# EAGLE design MintyStick-v3.0 (EAGLE 5.11)
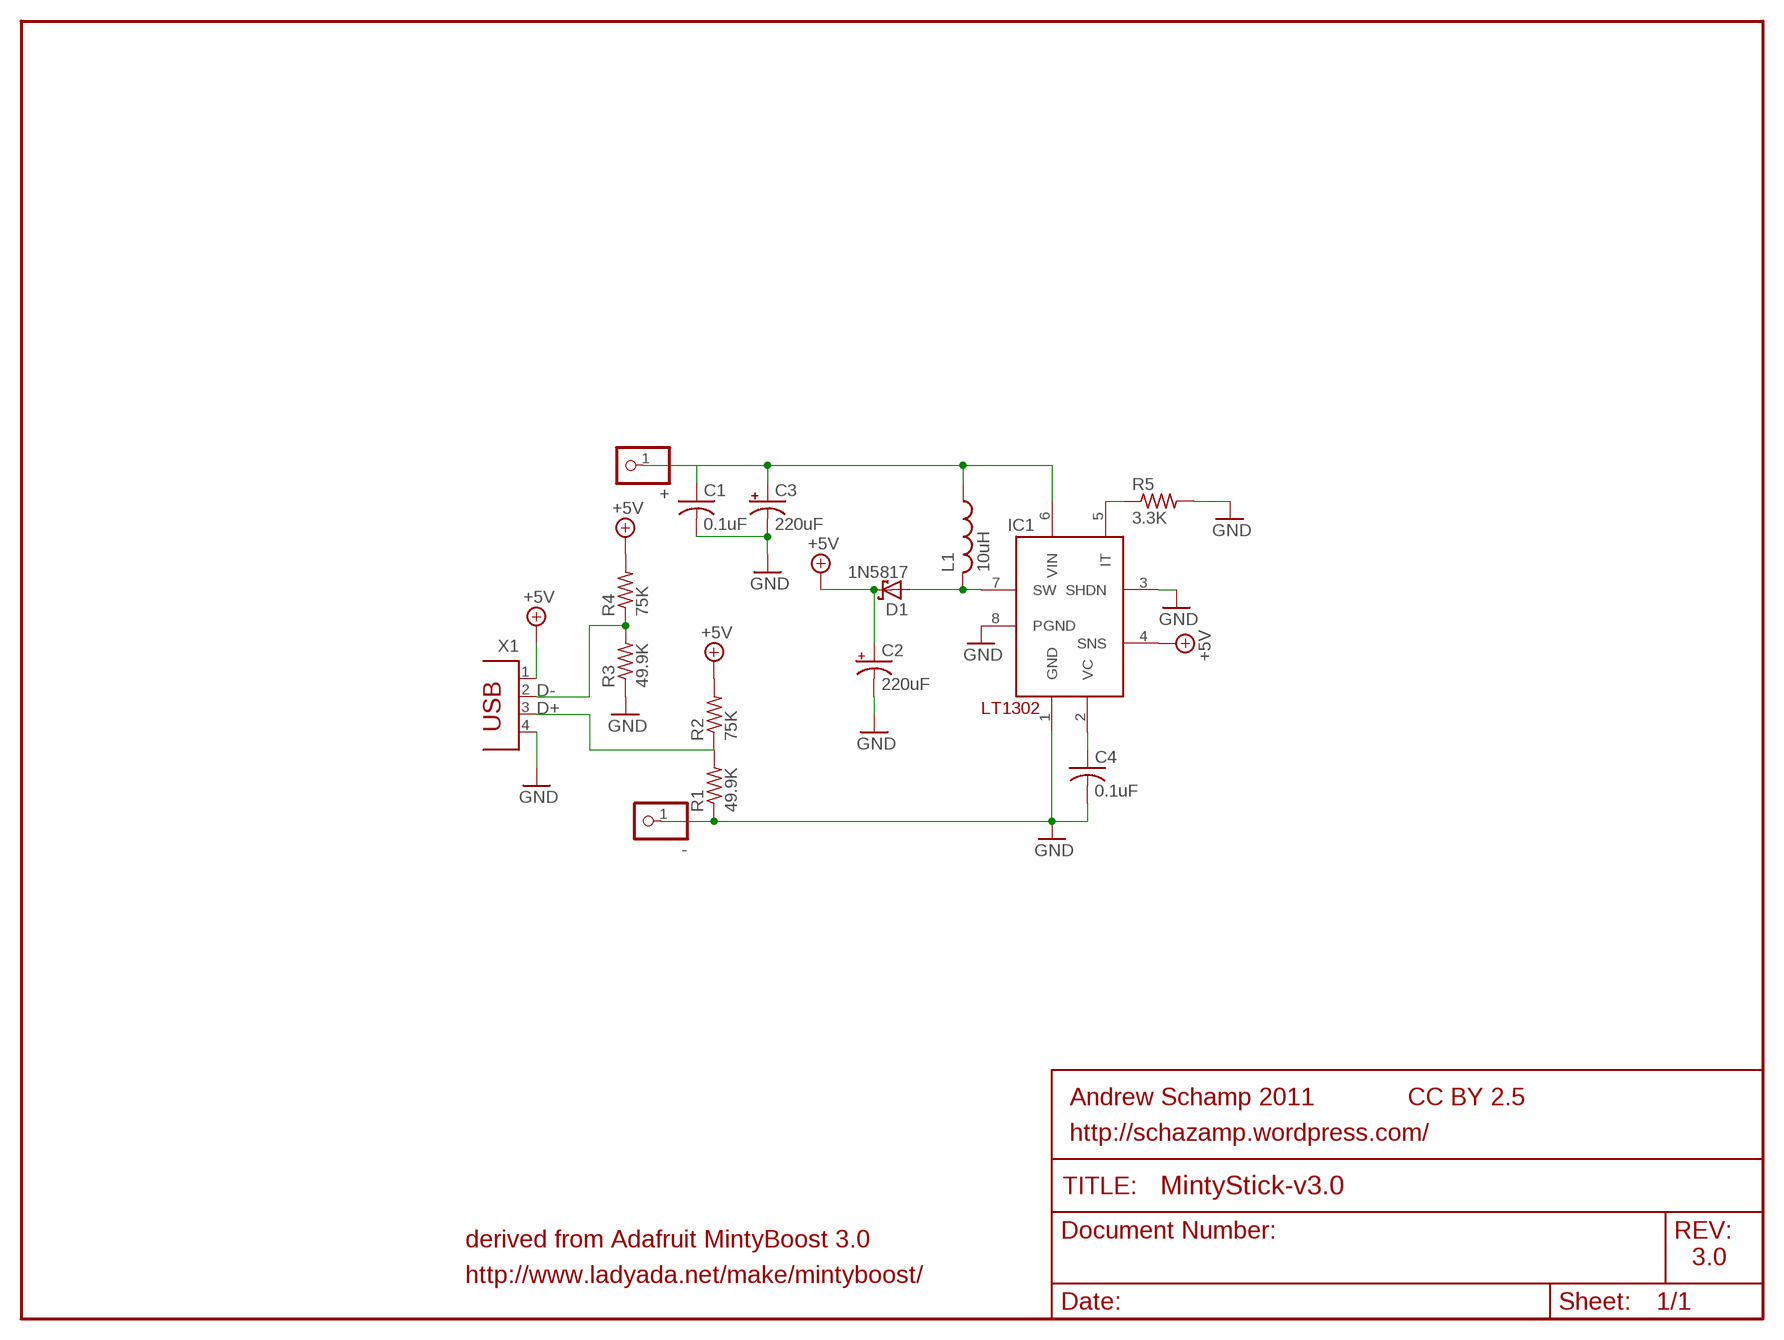
[diagram p0: schematic, sheet 1]

## Parts
+  PINHD-1X1  [1X01]
-  PINHD-1X1  [1X01]
C1  0.1uF  C-US025-024X044  [C025-024X044]
C2  220uF  CPOL-USE2.5-6  [E2,5-6]
C3  220uF  CPOL-USE2.5-6  [E2,5-6]
C4  0.1uF  C-US025-024X044  [C025-024X044]
D1  1N5817  SCHOTTKY-DIODEDO41  [DO41-10]
IC1  LT1302  [DIL08]
L1  10uH  L  [6000]
R1  49.9K  R-US_0207/7  [0207/7]
R2  75K  R-US_0207/7  [0207/7]
R3  49.9K  R-US_0207/7  [0207/7]
R4  75K  R-US_0207/7  [0207/7]
R5  3.3K  R-US_0207/5V  [0207/5V]
X1  PN87520  [PN87520]

## Nets
+5V: C2.+ D1.C IC1.4(SNS) R2.2 R4.2 X1.1
D+: R1.2 R2.1 X1.3
D-: R3.2 R4.1 X1.2
GND: -.1 C1.2 C2.- C3.- C4.2 IC1.1(GND) IC1.3(SHDN) IC1.8(PGND) R1.1 R3.1 R5.2 X1.4
N$1: C4.1 IC1.2(VC)
N$2: +.1 C1.1 C3.+ IC1.6(VIN) L1.1
N$3: IC1.5(IT) R5.1
N$5: D1.A IC1.7(SW) L1.2

## Notes on the sheet
- Andrew Schamp 2011 | CC BY 2.5
- http://schazamp.wordpress.com/
- derived from Adafruit MintyBoost 3.0
- 3.0
- http://www.ladyada.net/make/mintyboost/

## Library data of the parts
+ - = pinhead-ez:PINHD-1X1: PIN HEADER
C1 C4 = rcl-ez:C-US: CAPACITOR, American symbol
C2 C3 = rcl-ez:CPOL-US: POLARIZED CAPACITOR, American symbol
D1 = usbbuck:SCHOTTKY-DIODE: Schottky Diode
IC1 = usbbuck:LT1302
L1 = usbbuck:L
R1-R5 = rcl-ez:R-US_: RESISTOR, American symbol
X1 = con-berg:PN87520: BERG USB connector

## Board
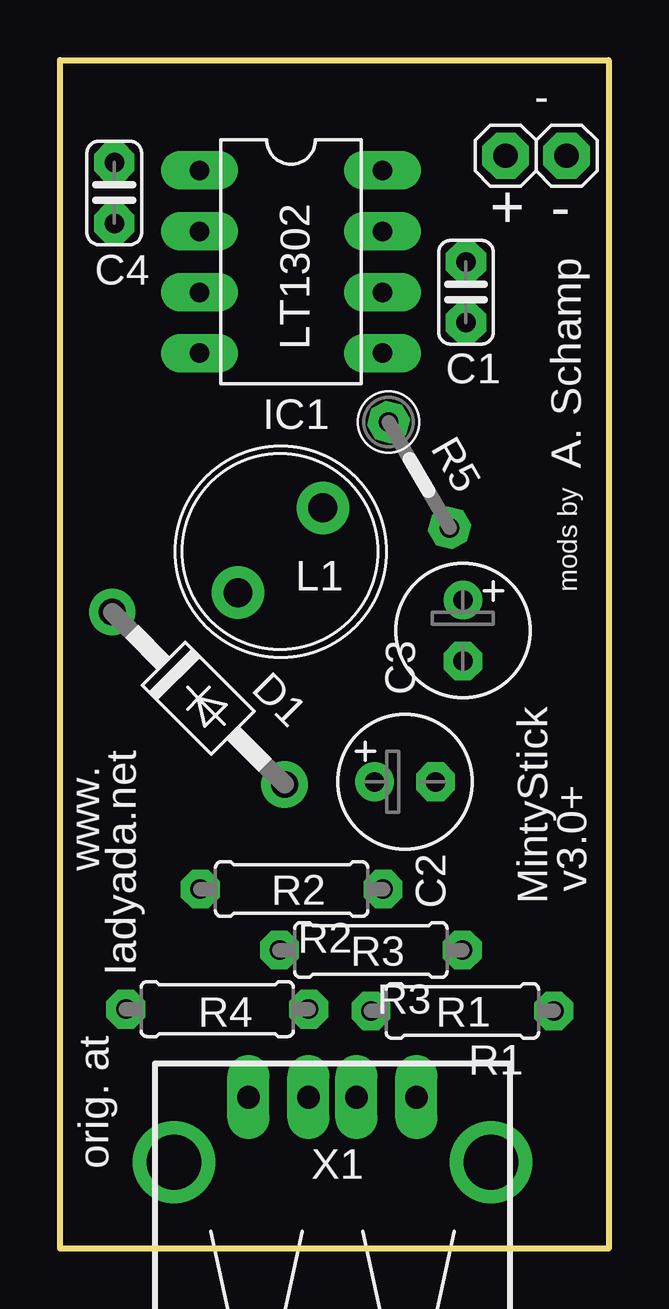
[diagram p1: board, top side]
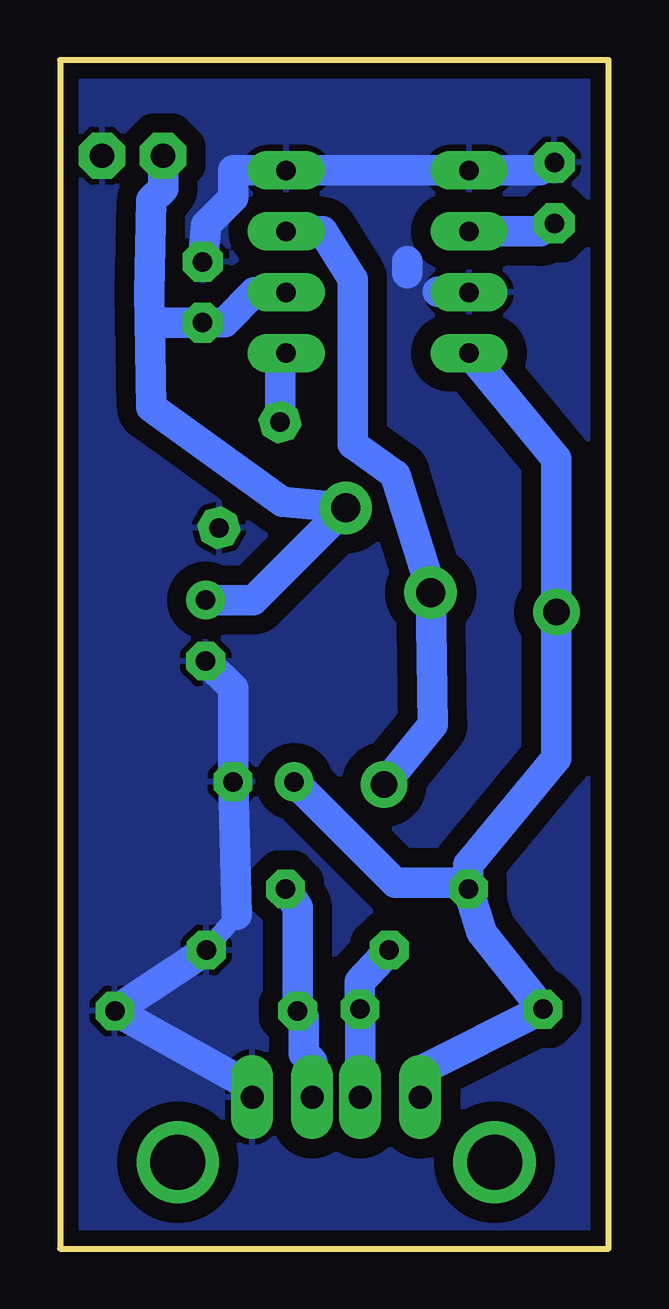
[diagram p2: board, bottom side, seen from below]

Size 22.86 x 49.53 mm. Coordinates in mm from the lower left corner, seen from the top.
Outline: 0,0 0,49.53 22.86,49.53 22.86,0 0,0
Copper layers (1*16): Top 0.035mm / dielectric 1.5mm / Bottom 0.035mm
Design rules "toner-transfer *": minimum track width 0.6mm, minimum drill 0.6mm, track to track 0.8mm, track to pad 0.8mm, pad to pad 0.8mm, via to via 0.8mm, smd to smd 8mil, copper to edge 10mil, drill to drill 8mil, minimum pad ring 0.4mm, minimum via ring 0.4mm, stop-mask expansion 4mil, vias tented up to drill 0mil, thermal gap 10mil

### Footprints (pad centres in the part's own frame; a part is rotated, then mirrored left to right if it is on the bottom)
1X01 = drill 1.016 pad 1.93 octagon: 1 0,0
C025-024X044 = drill 0.813 pad 1.676 octagon: 1 -1.27,0; 2 1.27,0
E2,5-6 = drill 0.813 pad 1.6 round: + -1.27,0 | drill 0.813 pad 1.6 octagon: - 1.27,0
DO41-10 = drill 1.118 pad 1.93 round: A 5.08,0; C -5.08,0
DIL08 = drill 0.813 long: 1 -3.81,-3.81; 2 -1.27,-3.81; 3 1.27,-3.81; 4 3.81,-3.81; 5 3.81,3.81; 6 1.27,3.81; 7 -1.27,3.81; 8 -3.81,3.81
6000 = drill 1.2 pad 2.184 round: 1 -2.5,0; 2 2.5,0
0207/7 = drill 0.813 octagon: 1 -3.81,0; 2 3.81,0
0207/5V = drill 0.813 pad 1.676 octagon: 1 -2.54,0; 2 2.54,0
PN87520 = drill 0.95 long: 1 -3.5,2.71; 2 -1,2.71; 3 1,2.71; 4 3.5,2.71 | drill 2.286 round: P$1 -6.604,0; P$2 6.604,0

### Placement (x,y rotation side)
+  18.57,45.54 0 top
-  21.11,45.54 0 top
C1  16.92,39.85 90 top
C2  14.38,19.46 0 top
C3  16.79,25.76 270 top
C4  2.26,43.99 90 top
D1  5.77,22.94 315 top
IC1  9.63,41.12 270 top
L1  9.19,29.1 225 top
R1  16.76,9.91 180 top
R2  9.65,14.99 180 top
R3  12.95,12.45 180 top
R4  6.55,9.98 180 top
R5  14.96,32.24 300 top
X1  11.35,3.61 0 top

### Tracks (layer width: path | path; a pad name or v marks a point on that pad's centre or on a via)
+5V
  Bottom 1.27: X1.1 7.85,7.41 R4.2 5.28,13.16 R2.2 | IC1.4 2.17,32.91 D1.C 2.17,20.43 5.84,16 R2.2 | C2.+ 8.89,15.24 6.1,15.24 R2.2
D+
  Bottom 1.27: R2.1 12.95,14.22 R1.2 12.7,9.65 12.7,8.13 12.35,7.78 X1.3
D-
  Bottom 0.813: R4.1
  Bottom 1.27: X1.2 R4.1 | R4.1 10.36,11.12 R3.2
GND
  Bottom 0.813: X1.4 14.85,6.73 | R3.1 15.49,13.92 | 6.83,44.93 6.6,44.7 6.04,44.7 IC1.1 | C4.2 2.84,44.93
  Bottom 1.27: 14.85,6.73 R1.1 R3.1 | 15.49,13.92 C2.- 15.65,23.34 C3.- | IC1.3 6.33,39.85 7.11,39.88 | 6.83,44.93 IC1.8 15.65,44.93 15.65,43.79 16.76,42.67 C1.2 | 8.38,40.64 8.38,41.15 | 2.84,44.93 IC1.1
  pour Bottom (isolate 0.635): -0.25,50.04 -0.51,0.76 23.11,0.76 23.37,50.04
N$1
  Bottom 0.813: C4.1 2.84,42.39
  Bottom 1.27: 2.84,42.39 IC1.2
N$2
  Bottom 1.016: 19.15,39.84 18.88,38.58
  Bottom 1.27: C3.+ 14.8,27.03 L1.1 13.6,31.12 19.05,35.05 19.15,39.84 19.05,43.69 18.57,44.17 +.1 18.54,45.57 | IC1.6 14.76,39.85 16,38.61 C1.1 18.88,38.58
N$3
  Bottom 0.813: 13.69,37.06 IC1.5
  Bottom 1.27: R5.1 13.69,37.06
N$5
  Bottom 0.813: L1.2 7.37,27.39
  Bottom 1.27: D1.A 7.33,21.84 L1.2 | IC1.7 11.91,42.39 10.67,40.39 10.67,33.53 8.89,32.26 7.37,27.39

### Text on the board
tPlace: + | - | C4 | LT1302 | C1 | IC1 | R5 | A. Schamp | mods by | L1 | C3 | D1 | MintyStick | C2 | www. | R2 | v3.0+ | ladyada.net | R3 | R4 | R1 | orig. at | X1